# Altium schematic sheet FPGA.SchDoc
size B
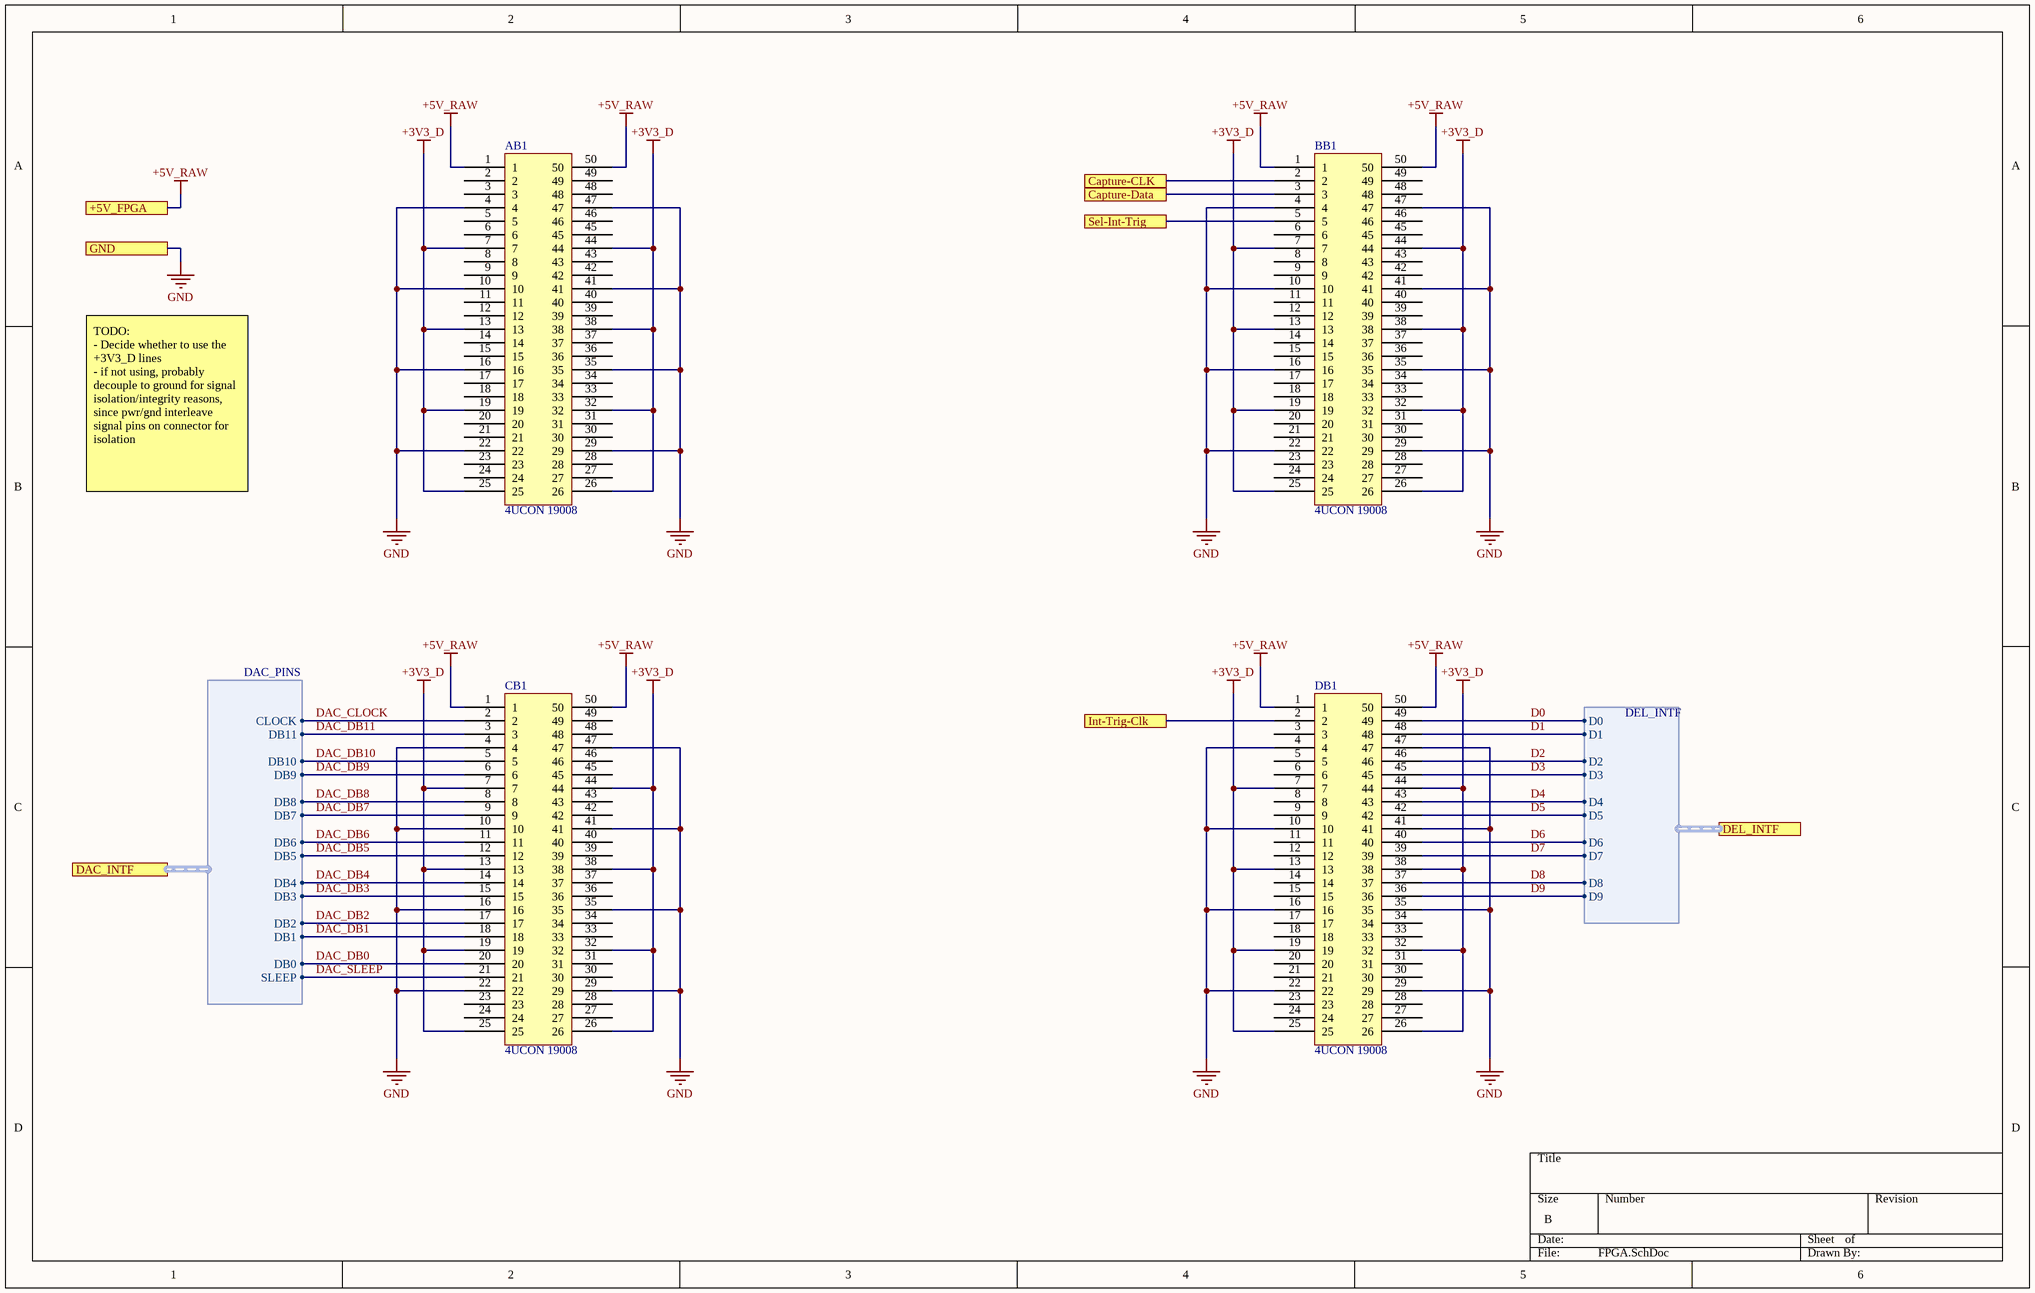
[diagram p0: FPGA.SchDoc]

## Parts
AB1  4UCON 19008  [4UCON_19008]
BB1  4UCON 19008  [4UCON_19008]
CB1  4UCON 19008  [4UCON_19008]
DB1  4UCON 19008  [4UCON_19008]

## Ports
+5V_FPGA, Capture-CLK, Capture-Data, DAC_INTF (harness DAC_PINS), DEL_INTF (harness DEL_INTF), GND, Int-Trig-Clk, Sel-Int-Trig

## Harnesses
DEL_INTF: D0, D1, D2, D3, D4, D5, D6, D7, D8, D9
DAC_PINS: DB0, DB1, DB2, DB3, DB4, DB5, DB6, DB7, DB8, DB9, DB10, DB11, CLOCK, SLEEP

## Nets
+3V3_D: AB1.7 AB1.13 AB1.19 AB1.25 AB1.26 AB1.32 AB1.38 AB1.44 BB1.7 BB1.13 BB1.19 BB1.25 BB1.26 BB1.32 BB1.38 BB1.44 CB1.7 CB1.13 CB1.19 CB1.25 CB1.26 CB1.32 CB1.38 CB1.44 DB1.7 DB1.13 DB1.19 DB1.25 DB1.26 DB1.32 DB1.38 DB1.44
+5V_RAW: AB1.1 AB1.50 BB1.1 BB1.50 CB1.1 CB1.50 DB1.1 DB1.50 ; port +5V_FPGA
GND: AB1.4 AB1.10 AB1.16 AB1.22 AB1.29 AB1.35 AB1.41 AB1.47 BB1.4 BB1.10 BB1.16 BB1.22 BB1.29 BB1.35 BB1.41 BB1.47 CB1.4 CB1.10 CB1.16 CB1.22 CB1.29 CB1.35 CB1.41 CB1.47 DB1.4 DB1.10 DB1.16 DB1.22 DB1.29 DB1.35 DB1.41 DB1.47 ; port GND
Capture-CLK: BB1.2 ; port Capture-CLK
Capture-Data: BB1.3 ; port Capture-Data
D0: DB1.49 ; port DEL_INTF.D0
D1: DB1.48 ; port DEL_INTF.D1
D2: DB1.46 ; port DEL_INTF.D2
D3: DB1.45 ; port DEL_INTF.D3
D4: DB1.43 ; port DEL_INTF.D4
D5: DB1.42 ; port DEL_INTF.D5
D6: DB1.40 ; port DEL_INTF.D6
D7: DB1.39 ; port DEL_INTF.D7
D8: DB1.37 ; port DEL_INTF.D8
D9: DB1.36 ; port DEL_INTF.D9
DAC_CLOCK: CB1.2 ; port DAC_INTF.CLOCK
DAC_DB0: CB1.20 ; port DAC_INTF.DB0
DAC_DB1: CB1.18 ; port DAC_INTF.DB1
DAC_DB2: CB1.17 ; port DAC_INTF.DB2
DAC_DB3: CB1.15 ; port DAC_INTF.DB3
DAC_DB4: CB1.14 ; port DAC_INTF.DB4
DAC_DB5: CB1.12 ; port DAC_INTF.DB5
DAC_DB6: CB1.11 ; port DAC_INTF.DB6
DAC_DB7: CB1.9 ; port DAC_INTF.DB7
DAC_DB8: CB1.8 ; port DAC_INTF.DB8
DAC_DB9: CB1.6 ; port DAC_INTF.DB9
DAC_DB10: CB1.5 ; port DAC_INTF.DB10
DAC_DB11: CB1.3 ; port DAC_INTF.DB11
DAC_SLEEP: CB1.21 ; port DAC_INTF.SLEEP
Int-Trig-Clk: DB1.2 ; port Int-Trig-Clk
Sel-Int-Trig: BB1.5 ; port Sel-Int-Trig

Not connected (* = marked no-connect by the designer): AB1 2 3 5 6 8 9 11 12 14 15 17 18 20 21 23 24 27 28 30 31 33 34 36 37 39 40 42 43 45 46 48 49; BB1 6 8 9 11 12 14 15 17 18 20 21 23 24 27 28 30 31 33 34 36 37 39 40 42 43 45 46 48 49; CB1 23 24 27 28 30 31 33 34 36 37 39 40 42 43 45 46 48 49; DB1 3 5 6 8 9 11 12 14 15 17 18 20 21 23 24 27 28 30 31 33 34

## Notes on the sheet
- TODO:
  - Decide whether to use the +3V3_D lines
  - if not using, probably decouple to ground for signal isolation/integrity reasons, since pwr/gnd interleave signal pins on connector for isolation